# EAGLE design eLite Clock - Main (EAGLE 9.6.0)
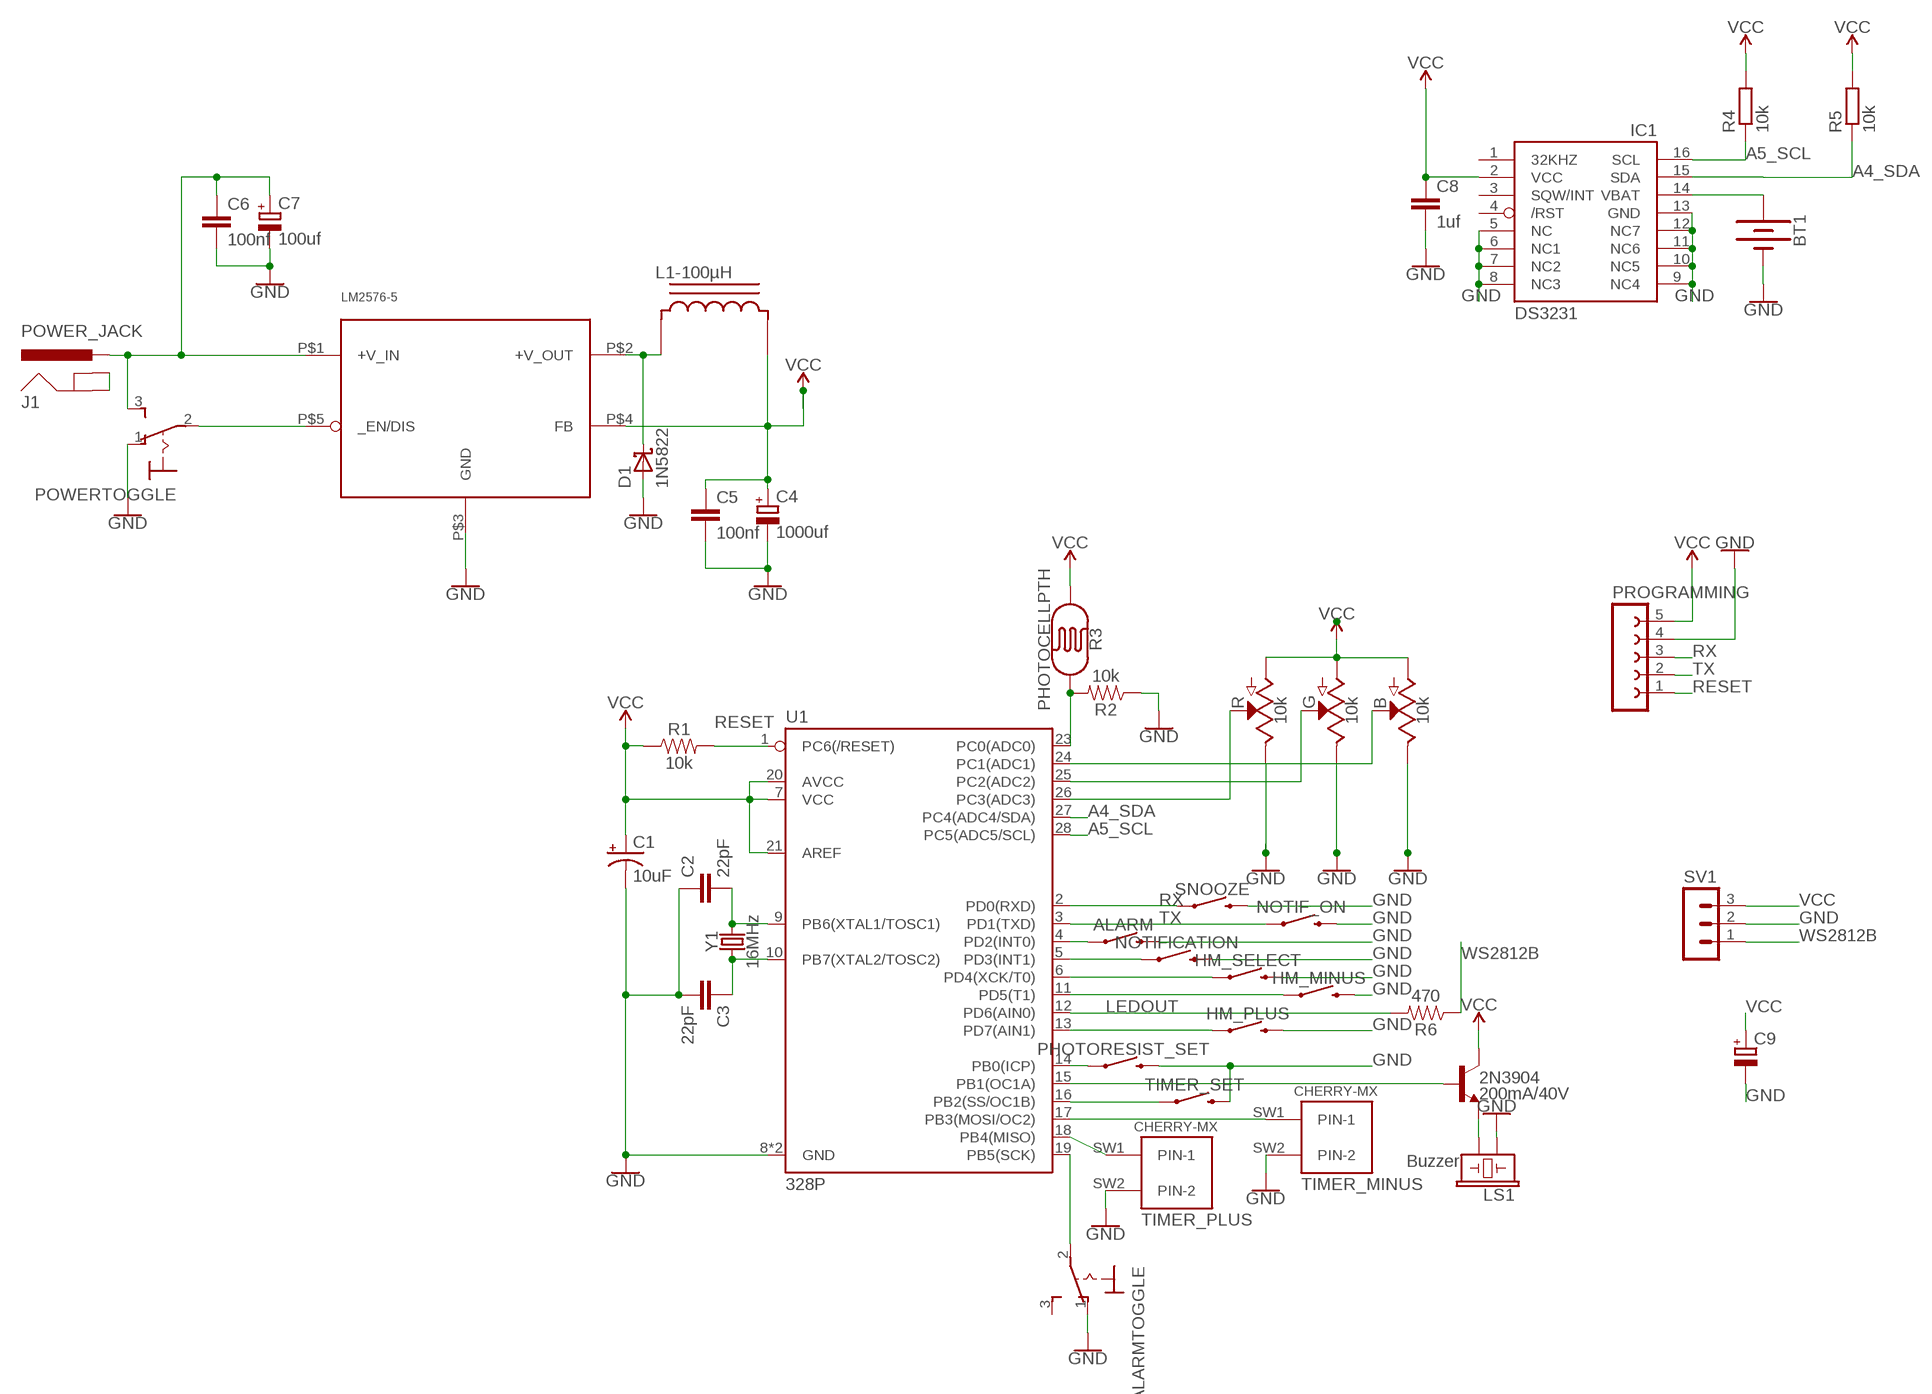
[diagram p0: schematic, sheet 1]

## Parts
2N3904  200mA/40V  TRANS_NPN-2N3904  [TO-92]
ALARM  MOMENTARY-SWITCH-SPST-PTH-6.0MM  [TACTILE_SWITCH_PTH_6.0MM]
ALARMTOGGLE  320-916  [320-916]
B  10k  POT  [SINGLE_GANK_POTENTIOMETER]
BT1  BATTERY-20MM_PTH  [BATTCOM_20MM_PTH]
C1  10uF  10UF-POLAR-RADIAL-2.5MM-25V-20%  [CPOL-RADIAL-2.5MM-5MM]
C2  22pF  22PF-PTH-2.54MM-200V-5%  [CAP-PTH-2.54]
C3  22pF  22PF-PTH-2.54MM-200V-5%  [CAP-PTH-2.54]
C4  1000uf  CPOL-EUE5-13  [E5-13]
C5  100nf  C-EU025-025X050  [C025-025X050]
C6  100nf  C-EU025-025X050  [C025-025X050]
C7  100uf  CPOL-EUE2.5-5  [E2,5-5]
C8  1uf  C-EU025-025X050  [C025-025X050]
C9  CPOL-EUE3.5-10  [E3,5-10]
D1  1N5822  [DIOAD2120W130L950D530P]
G  10k  POT  [SINGLE_GANK_POTENTIOMETER]
HM_MINUS  MOMENTARY-SWITCH-SPST-PTH-6.0MM  [TACTILE_SWITCH_PTH_6.0MM]
HM_PLUS  MOMENTARY-SWITCH-SPST-PTH-6.0MM  [TACTILE_SWITCH_PTH_6.0MM]
HM_SELECT  MOMENTARY-SWITCH-SPST-PTH-6.0MM  [TACTILE_SWITCH_PTH_6.0MM]
IC1  DS3231/SO  [SO16W]
J1  POWER_JACK  [POWER_JACK_PTH]
L1-100µH  T37_INDUCTOR  [T37_INDUCTOR]
LM2576-5  LM2576-T05A  [TO-220-5_IN-LINE]
LS1  Buzzer  BUZZER-PTH  [BUZZER-12MM]
NOTIF_ON  MOMENTARY-SWITCH-SPST-PTH-6.0MM  [TACTILE_SWITCH_PTH_6.0MM]
NOTIFICATION  MOMENTARY-SWITCH-SPST-PTH-6.0MM  [TACTILE_SWITCH_PTH_6.0MM]
PHOTORESIST_SET  MOMENTARY-SWITCH-SPST-PTH-6.0MM  [TACTILE_SWITCH_PTH_6.0MM]
POWERTOGGLE  320-916  [320-916]
PROGRAMMING  FE05-1  [FE05-1]
R  10k  POT  [SINGLE_GANK_POTENTIOMETER]
R1  10k  10KOHM-HORIZ-1/4W-1%  [AXIAL-0.3]
R2  10k  10KOHM-HORIZ-1/4W-1%  [AXIAL-0.3]
R3  PHOTOCELLPTH  [PHOTOCELL]
R4  10k  R-EU_0207/7  [0207/7]
R5  10k  R-EU_0207/7  [0207/7]
R6  470  10KOHM-HORIZ-1/4W-1%  [AXIAL-0.3]
SNOOZE  MOMENTARY-SWITCH-SPST-PTH-6.0MM  [TACTILE_SWITCH_PTH_6.0MM]
SV1  MA03-1  [MA03-1]
TIMER_MINUS  TIMER_PLUS  CHERRY-MX  [CHERRY-MX]
TIMER_PLUS  TIMER_MINUS  CHERRY-MX  [CHERRY-MX]
TIMER_SET  MOMENTARY-SWITCH-SPST-PTH-6.0MM  [TACTILE_SWITCH_PTH_6.0MM]
U1  328P  ATMEGA328P_PDIP  [DIP28]
Y1  16MHz  CRYSTAL-16MHZPTH-HC49US  [HC49US]

## Nets
A4_SDA: IC1.15(SDA) R5.1 U1.27(PC4(ADC4/SDA))
A5_SCL: IC1.16(SCL) R4.1 U1.28(PC5(ADC5/SCL))
GND: ALARM.3 ALARMTOGGLE.1(O) B.P$1 BT1.2(-) C1.2(-) C2.1 C3.2 C4.- C5.2 C6.2 C7.- C8.2 C9.- D1.A G.P$1 HM_MINUS.3 HM_PLUS.3 HM_SELECT.3 IC1.5(NC) IC1.6(NC1) IC1.7(NC2) IC1.8(NC3) IC1.9(NC4) IC1.10(NC5) IC1.11(NC6) IC1.12(NC7) IC1.13(GND) LM2576-5.P$3(GND) LS1.+ NOTIF_ON.3 NOTIFICATION.3 PHOTORESIST_SET.3 POWERTOGGLE.1(O) PROGRAMMING.4 R2.P$1 R.P$1 SNOOZE.3 SV1.2 TIMER_MINUS.SW2(PIN-2) TIMER_PLUS.SW2(PIN-2) TIMER_SET.3 U1.8(GND) U1.22(GND)
LEDOUT: R6.P$2 U1.12(PD6(AIN0))
N$1: J1.GND J1.GNDBREAK
N$2: C2.2 U1.9(PB6(XTAL1/TOSC1)) Y1.2
N$3: C3.1 U1.10(PB7(XTAL2/TOSC2)) Y1.1
N$4: ALARM.1 U1.4(PD2(INT0))
N$5: NOTIFICATION.1 U1.5(PD3(INT1))
N$6: HM_SELECT.1 U1.6(PD4(XCK/T0))
N$7: HM_MINUS.1 U1.11(PD5(T1))
N$8: PHOTORESIST_SET.1 U1.14(PB0(ICP))
N$9: HM_PLUS.1 U1.13(PD7(AIN1))
N$10: TIMER_MINUS.SW1(PIN-1) U1.17(PB3(MOSI/OC2))
N$11: TIMER_SET.1 U1.16(PB2(SS/OC1B))
N$12: TIMER_PLUS.SW1(PIN-1) U1.18(PB4(MISO))
N$13: 2N3904.2(B) U1.15(PB1(OC1A))
N$14: 2N3904.1(E) LS1.-
N$15: ALARMTOGGLE.2(P) U1.19(PB5(SCK))
N$16: R2.P$2 R3.2 U1.23(PC0(ADC0))
N$17: R.P$2 U1.26(PC3(ADC3))
N$18: D1.C L1-100µH.CB LM2576-5.P$2(+V_OUT)
N$19: LM2576-5.P$5(_EN/DIS) POWERTOGGLE.2(P)
N$21: G.P$2 U1.25(PC2(ADC2))
N$22: B.P$2 U1.24(PC1(ADC1))
N$24: C6.1 C7.+ J1.PWR LM2576-5.P$1(+V_IN) POWERTOGGLE.3(S)
N$26: BT1.1(+) IC1.14(VBAT)
RESET: PROGRAMMING.1 R1.P$2 U1.1(PC6(/RESET))
RX: PROGRAMMING.3 SNOOZE.1 U1.2(PD0(RXD))
TX: NOTIF_ON.1 PROGRAMMING.2 U1.3(PD1(TXD))
VCC: 2N3904.3(C) B.P$3 C1.1(+) C4.+ C5.1 C8.1 C9.+ G.P$3 IC1.2(VCC) L1-100µH.CA LM2576-5.P$4(FB) PROGRAMMING.5 R1.P$1 R3.1 R4.2 R5.2 R.P$3 SV1.3 U1.7(VCC) U1.20(AVCC) U1.21(AREF)
WS2812B: R6.P$1 SV1.1
Unconnected: ALARMTOGGLE.3(S) IC1.1(32KHZ) IC1.3(SQW/INT) IC1.4(/RST)

## Library data of the parts
2N3904 = SparkFun-DiscreteSemi:TRANS_NPN: NPN transistor Current controlled devices typically used to amplify current or used as a switch. BC547 - COM-08928 <http://www.sparkfun.com/products/8928> (TO-92 45V 100mA) (1.Collector 2.Base 3.Emitter) 2N3904 - COM-00521 <http://www.sparkfun.com/products/521> (TO-92 40V 200mA) (1.Emitter 2.Base 3.Collector) P2N2222A - COM-12852 <http://www.sparkfun.com/products/12852> (TO-92 40V 600mA) (1.Collector 2.Base 3.Emitter); PROD_ID: TRANS-08447
ALARM HM_MINUS HM_PLUS HM_SELECT NOTIF_ON NOTIFICATION PHOTORESIST_SET SNOOZE TIMER_SET = SparkFun-Switches:MOMENTARY-SWITCH-SPST: Momentary Switch (Pushbutton) - SPST Normally-open (NO) SPST momentary switches (buttons, pushbuttons). Variants PTH-12MM - 12mm square, through-hole Momentary Pushbutton Switch - 12mm Square <https://www.sparkfun.com/products/9190> (COM-09190) PTH-6.0MM, PTH-6.0MM-KIT - 6.0mm square, through-hole Mini Pushbutton Switch <https://www.sparkfun.com/products/97> (COM-00097) KIT package intended for soldering kit's - only one side of pads' copper is exposed. PTH-RIGHT-ANGLE-KIT - Right-angle, through-hole Right Angle Tactile Button <https://www.sparkfun.com/products/10791> - Used on SparkFun BigTime Watch Kit <https://www.sparkfun.com/products/11734> SMD-12MM - 12mm square, surface-mount Tactile Button - SMD (12mm) <https://www.sparkfun.com/products/12993> (COM-12993) Used on SparkFun PicoBoard <https://www.sparkfun.com/products/11888> SMD-4.5MM - 4.5mm Square Trackball Switch Used on SparkFun Blackberry Trackballer Breakout <https://www.sparkfun.com/products/13169> SMD-4.6MMX2.8MM - 4.60mm x 2.80mm, surface mount Used on SparkFun SAMD21 Mini Breakout <https://www.sparkfun.com/products/13664> SMD-5.2MM, SMD-5.2-REDUNDANT - 5.2mm square, surface-mount Mini Pushbutton Switch - SMD <https://www.sparkfun.com/products/8720> (COM-08720) Used on Arduino Pro Mini <https://www.sparkfun.com/products/11114> REDUNDANT package connects both switch circuits together SMD-6.0X3.5MM - 6.0 x 3.5mm, surface mount Momentary Reset Switch SMD <https://www.sparkfun.com/products/8229> (COM-08229) SMD-6.2MM-TALL - 6.2mm square, surface mount Tactile Button - SMD (6mm) <https://www.sparkfun.com/products/12992> Used on SparkFun Digital Sandbox <https://www.sparkfun.com/products/12651> SMD-RIGHT-ANGLE - Right-angle, surface mount Used on SparkFun Block for Intel® Edison - Arduino <https://www.sparkfun.com/products/13036>; PROD_ID: SWCH-08441; SF_SKU: COM-00097
ALARMTOGGLE POWERTOGGLE = switch:320-916: TOGGLE SWITCH distributor RS Components
B G R = SingleGankPotentiometer:POT
BT1 = SparkFun-Batteries:BATTERY: Battery - Single Cell A variety of battery chemistries, sizes, and footprints. Device List: 20MM_PTH - Coin Cell Battery Holder - 20mm (PTH) <https://www.sparkfun.com/products/783> 20MM_PTH_KIT- Coin Cell battery Holder - 20 mm (PTH) <http://www.sparkfun.com/products/783>kit version with special mask 6.8MM_PTH - Coin Cell Battery Holder - 6.8MM(SMD) <https://www.digikey.com/product-detail/en/seiko-instruments/MS621FE-FL11E/728-1057-ND/1889208?WT.srch=1&gclid=CNOQ5a6LzdQCFZS2wAodXCkE0g> 12MM_SMD - Coin Cell Battery Holder - 12mm (SMD) <https://www.sparkfun.com/products/10592> 12MM_PTH - Coin Cell Battery Holder - 12mm (PTH) <https://www.sparkfun.com/products/7948> 20MM_SMD - 20mm Coin Cell Battery Holder (SMD) (2 legs) Used on the Big Time Watch Kit <https://www.sparkfun.com/products/11734> 20MM_SMD_4LEGS - Coin Cell Battery Holder - 20mm (SMD) <https://www.sparkfun.com/products/11892> 20MM_SMD_4LEGS_OVERPASTE - Coin Cell Battery Holder - 20mm (SMD) <https://www.sparkfun.com/products/11892> (Over-paste on the legs) 24.5MM_PTH - Coin Cell Battery Holder - 24.5mm (PTH) <https://www.sparkfun.com/products/8863> 9V - 9V Battery Holder - PC Mount Used on the SparkFun SparkPunk Sound Kit <https://www.sparkfun.com/products/11177> and SparkFun SparkPunk Sequencer Kit <https://www.sparkfun.com/products/12707> 18650 - Battery Holder - 18650 (PTH) <https://www.sparkfun.com/products/13113> AA - Battery Holder - 1xAA (PTH) <https://www.sparkfun.com/products/7949> AAA - Battery Holder - 1xAAA (PTH) <https://www.sparkfun.com/products/12718> AA_KIT - Battery Holder - 1xAA (PTH) <https://www.sparkfun.com/products/7949> Special kit package - pads only have exposed copper on one side of the board. AAA_KIT - Battery Holder - 1xAAA (PTH) <https://www.sparkfun.com/products/12718> Special kit package - pads only have exposed copper on one side of the board.; PROD_ID: BATT-09031; SF_SKU: PRT-00783
C1 = SparkFun-Capacitors:10UF-POLAR: 10.0µF polarized capacitors A capacitor is a passive two-terminal electrical component used to store electrical energy temporarily in an electric field.; PROD_ID: CAP-08440
C2 C3 = SparkFun-Capacitors:22PF: 22pF ceramic capacitors A capacitor is a passive two-terminal electrical component used to store electrical energy temporarily in an electric field.; PROD_ID: CAP-09128
C4 C7 C9 = rcl:CPOL-EU: POLARIZED CAPACITOR, European symbol; SPICEPREFIX: C
C5 C6 C8 = rcl:C-EU: CAPACITOR, European symbol; SPICEPREFIX: C
D1 = 1N5822:1N5822: 1N5822 Series 40 V 3 A Through Hole Schottky Rectifier - DO-201AD; AVAILABILITY: Unavailable; DESCRIPTION: Schottky Barrier Rectifier, 3.0 A, 40 V; MF: STMicroelectronics; MP: 1N5822; PACKAGE: SQ-MELF B ON Semiconductor; PRICE: None
IC1 = adafruit:DS3231
J1 = SparkFun-Connectors:POWER_JACK: Power Jack Connector This is the standard 5.5mm barrel jack for power. The PTH is the most common, proven, reliable, footprint. The Slot footprint only works if the mill layer is transmitted to the PCB fab house so be warned. Here are the connectors we sell at SparkFun: DC Barrel Power Jack/Connector <https://www.sparkfun.com/products/119> (PRT-00119) DC Barrel Power Jack/Connector (SMD) <https://www.sparkfun.com/products/12748> (PRT-12748) DC Barrel Jack Adapter - Breadboard Compatible <https://www.sparkfun.com/products/10811> (PRT-10811) It is used on this SparkFun product (and many, many others): SparkFun RedBoard - Programmed with Arduino <https://www.sparkfun.com/products/12757> (DEV-12757) Also, if you need a mating power supply or connector, please check these out: Wall Adapter Power Supply - 9VDC 650mA <https://www.sparkfun.com/products/298> (TOL-00298) DC Barrel Jack Adapter - Male <https://www.sparkfun.com/products/10287> (PRT-10287); PROD_ID: CONN-08197
L1-100µH = toroid:T37_INDUCTOR: Inductor wound on a T37 Toroid
LM2576-5 = LM2576:LM2576-T05A: LM2576/LM2576HV Series SIMPLE SWITCHER® 3A Step-Down Voltage Regulator IN-LINE PACKAGE; SPICEPREFIX: X
LS1 = SparkFun-Electromechanical:BUZZER: Buzzer Small round buzzers that operate around the audible 2kHz range. You can use these as speakers to create simple music or user interfaces. Variant Overview: PTH - Mini Speaker - PC Mount 12mm 2.048kHz <https://www.sparkfun.com/products/7950> PTH_KIT - Mini Speaker - PC Mount 12mm 2.048kHz <https://www.sparkfun.com/products/7950> KIT simplifies soldering by adding stop mask to one side of the pads. PTH_NO_SILK - Mini Speaker - PC Mount 12mm 2.048kHz <https://www.sparkfun.com/products/7950> No silkscreen indicator of buzzer outline. PTH_KIT_NO_SILK - Mini Speaker - PC Mount 12mm 2.048kHz <https://www.sparkfun.com/products/7950> KIT package w/o silkscreen SMD - Buzzer Audio Magnetic (CCV-084B16) SMD buzzer used on, e.g. the LilyPad Buzzer <https://www.sparkfun.com/products/8463> and RFID USB Reader <https://www.sparkfun.com/products/9963>. SMD_KIT - Buzzer Audio Magnetic (CCV-084B16) SMD Buzzer with elongated pins to make soldering easier. Used on the SparkFun Simon Says - Surface Mount Soldering Kit <https://www.sparkfun.com/products/10935>.; PROD_ID: COMP-08253; SF_SKU: COM-07950
PROGRAMMING = con-lsta:FE05-1: FEMALE HEADER; OC_FARNELL: unknown; OC_NEWARK: unknown
R1 R2 = SparkFun-Resistors:10KOHM: 10kΩ resistor A resistor is a passive two-terminal electrical component that implements electrical resistance as a circuit element. Resistors act to reduce current flow, and, at the same time, act to lower voltage levels within circuits. - Wikipedia; PROD_ID: RES-12183
R3 = SparkFun-Sensors:PHOTOCELL: Photocell (Photodetector, Photo Resistor, CdS) This is a very small light sensor. A photocell changes (also called a photodetector, photo resistor, CdS or photoconductive cell) resistance depending on the amount of light it is exposed to. These little sensors make great ambient light triggers (when light in the room turns on, do something). Datasheet <http://cdn.sparkfun.com/datasheets/Sensors/LightImaging/SEN-09088.pdf> SparkFun Products Mini Photocell <https://www.sparkfun.com/products/9088> (SEN-09088); PROD_ID: COMP-09129; SF_ID: SEN-09088
R4 R5 = rcl:R-EU_: RESISTOR, European symbol; SPICEPREFIX: R
R6 = SparkFun-Resistors:10KOHM: 10kΩ resistor A resistor is a passive two-terminal electrical component that implements electrical resistance as a circuit element. Resistors act to reduce current flow, and, at the same time, act to lower voltage levels within circuits. - Wikipedia; PROD_ID: RES-12183; VALUE: 10k
SV1 = con-lstb:MA03-1: PIN HEADER; OC_FARNELL: unknown; OC_NEWARK: unknown
TIMER_MINUS TIMER_PLUS = cherrymx:CHERRY-MX: Cherry MX series keyswitch
U1 = SparkFun-IC-Microcontroller:ATMEGA328P_PDIP: Atmel 328P Through hole ATMEGA328P uC used in the Arduino 32kb flash, 1k EEPROM, 2k SRAM Datasheet <http://www.sparkfun.com/datasheets/Components/SMD/ATMega328.pdf> SparkFun Products Storefront component: AVR 28 Pin 20MHz 32K 6A/D - ATMega328P <https://www.sparkfun.com/products/9061> (COM-09061) SparkFun Simon Says - Through-Hole Soldering Kit <https://www.sparkfun.com/products/10547> (KIT-10547) SparkFun Learn to Solder - Simon Says <https://www.sparkfun.com/products/13708> (KIT-13708) SparkFun BigTime Watch Kit <https://www.sparkfun.com/products/11734> (KIT-11734) SparkFun ClockIt <https://www.sparkfun.com/products/10930> (KIT-10930) SparkFun Serial Enabled LCD Kit <https://www.sparkfun.com/products/10097> (LCD-10097) SparkFun Simon Tilts - Through Hole Soldering Kit <https://www.sparkfun.com/products/12634> (KIT-12634) SparkFun Frequency Counter Kit <https://www.sparkfun.com/products/10140> (KIT-10140) FabFM Radio Kit <https://www.sparkfun.com/products/11043> (KIT-11043) SparkFun Binary Blaster Kit <https://www.sparkfun.com/products/12037> (KIT-12037) SparkFun Metro-Gnome <https://www.sparkfun.com/products/9236> (KIT-09236) ATmega328 with Arduino Optiboot (Uno) <https://www.sparkfun.com/products/10524> (DEV-10524); PROD_ID: IC-09136
Y1 = SparkFun-Clocks:CRYSTAL-16MHZ: 16MHz Crystal Digikey Example <http://www.digikey.com/product-search/en?keywords=535-9122-1-ND> Frequency: 16MHz Frequency Stability: ±50ppm Frequency Tolerance: ±20ppm Load Capacitance: 18pF SparkFun Products: Pro Micro -5V/16MHz <https://www.sparkfun.com/products/12640> SparkFun Serial Enabled LCD Kit <https://www.sparkfun.com/products/10097>; PROD_ID: XTAL-08181; SF_ID: COM-00536

## Board
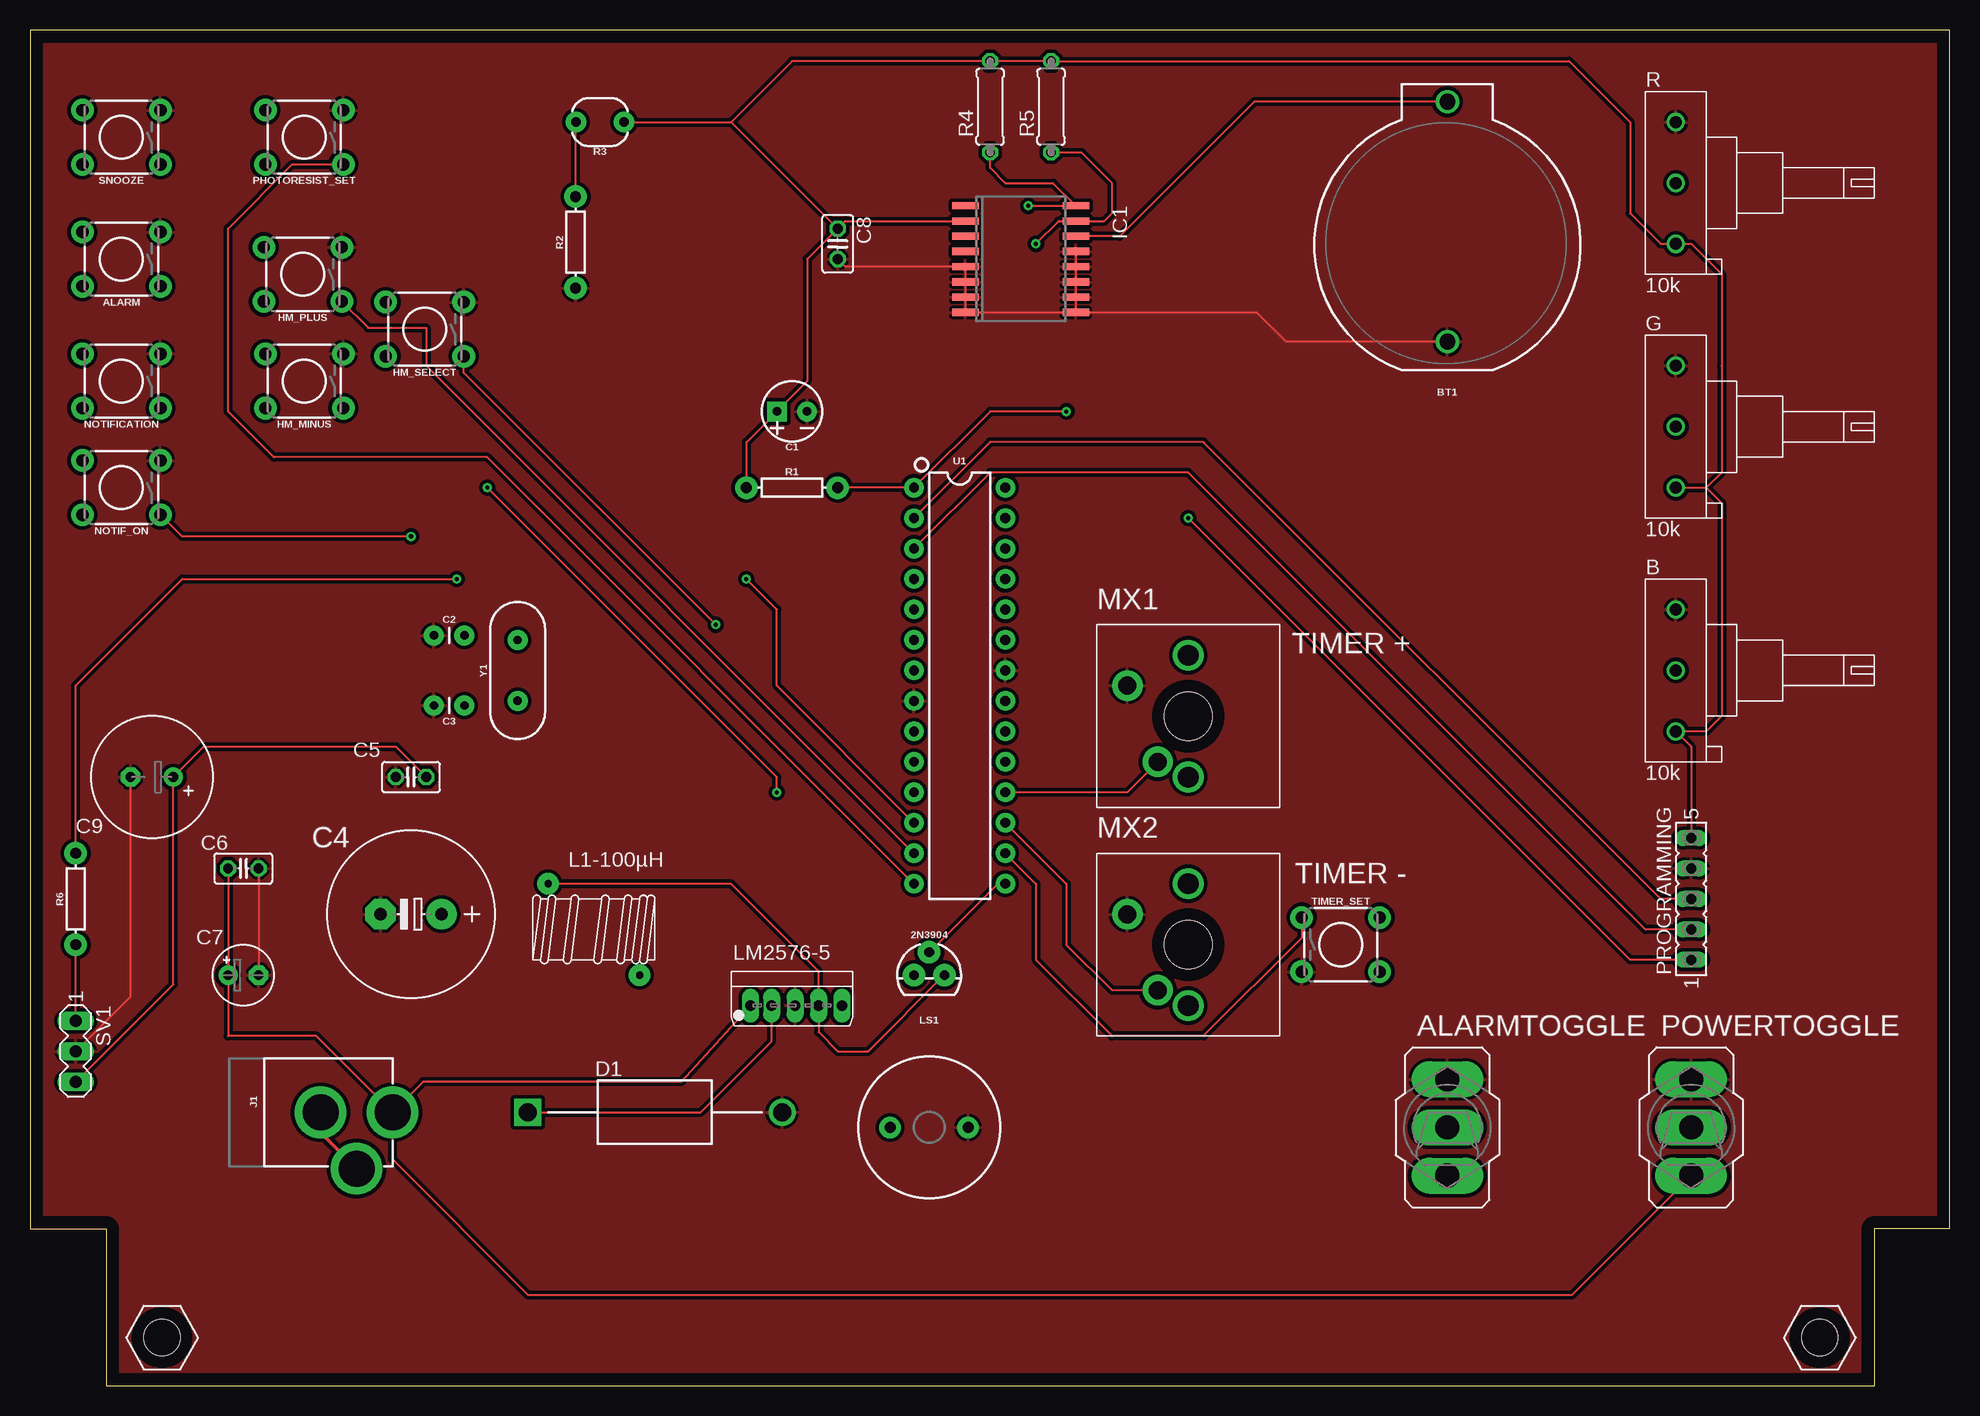
[diagram p1: board, top side]
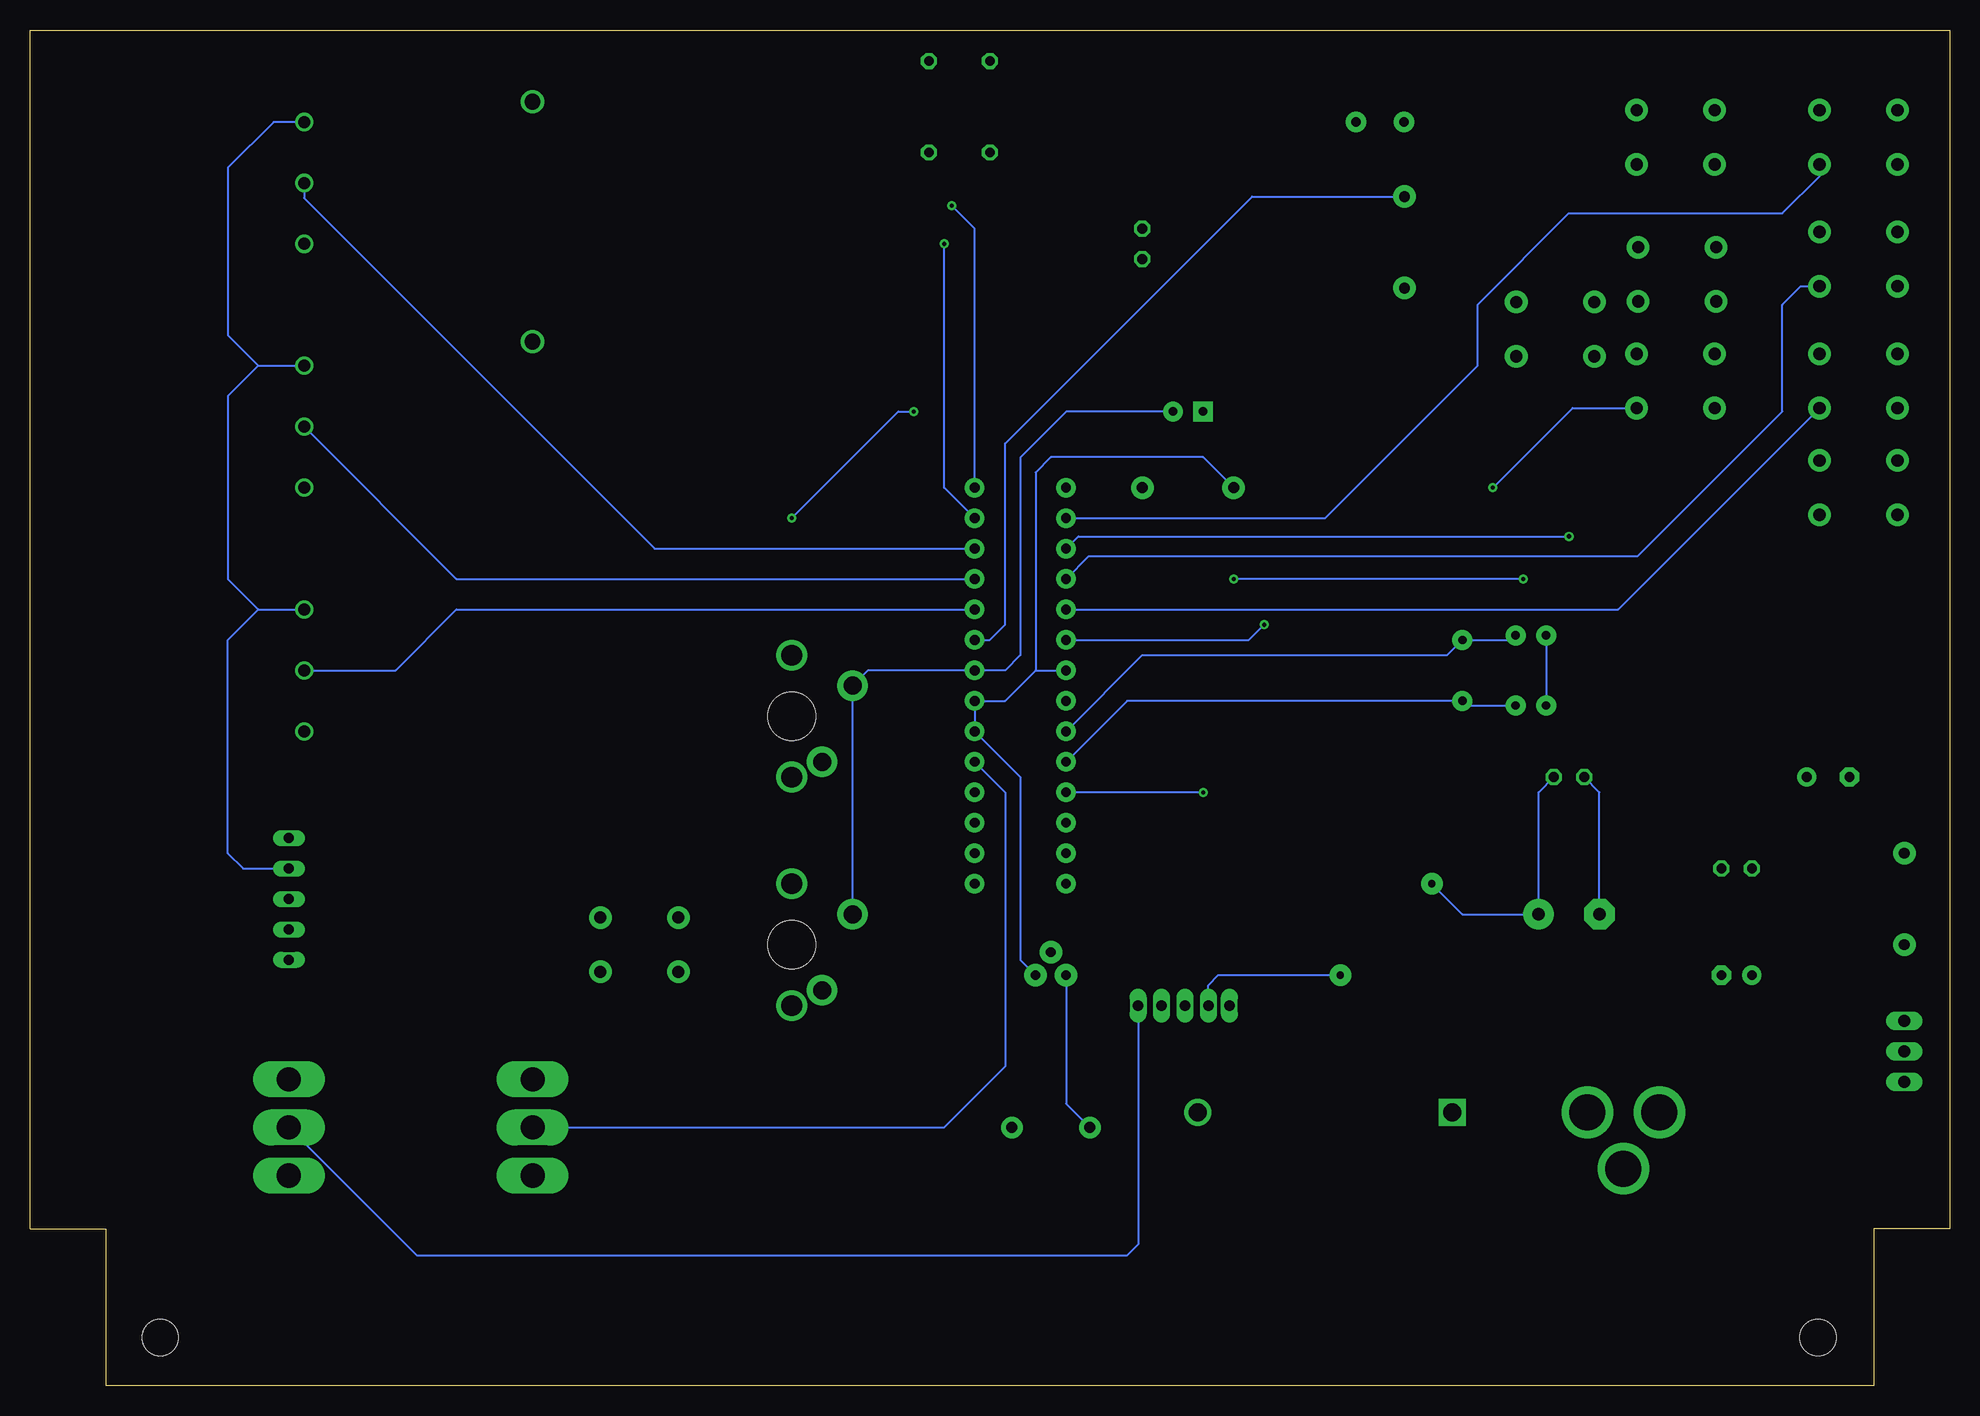
[diagram p2: board, bottom side, seen from below]

Size 160 x 113 mm. Coordinates in mm from the lower left corner, seen from the top.
Outline: 6.35,0 153.67,0 153.67,13.05 160,13.05 160,113 0,113 0,13.05 6.35,13.05 6.35,0
Copper layers (1*16): Top 0.035mm / dielectric 1.5mm / Bottom 0.035mm
Design rules "default": minimum track width 6mil, minimum drill 0.35mm, track to track 6mil, track to pad 6mil, pad to pad 6mil, via to via 6mil, smd to smd 6mil, copper to edge 40mil, drill to drill 6mil, minimum pad ring 10mil, minimum via ring 8mil, stop-mask expansion 4mil, vias tented up to drill 0mil, thermal gap 10mil
Holes 3 mm at 11,4 149.15,4

### Footprints (pad centres in the part's own frame; a part is rotated, then mirrored left to right if it is on the bottom)
TO-92 = drill 0.813 pad 1.88: 1 -1.27,0; 2 0,1.905; 3 1.27,0
TACTILE_SWITCH_PTH_6.0MM = drill 1.016 pad 1.88: 1 -3.251,2.261; 2 3.251,2.261; 3 -3.251,-2.261; 4 3.251,-2.261
320-916 = drill 2.007 long: 1 0,4.013; 2 0,0; 3 0,-4.013
SINGLE_GANK_POTENTIOMETER = drill 1: P$1 0,0; P$2 0,-5.08; P$3 0,-10.16
BATTCOM_20MM_PTH = drill 1.3: 1 11.85,0; 2 -8.15,0
CPOL-RADIAL-2.5MM-5MM = drill 0.7 pad 1.651 square: 1 1.25,0 | drill 0.7 pad 1.651: 2 -1.25,0
CAP-PTH-2.54 = drill 0.7 pad 1.651: 1 -1.27,0; 2 1.27,0
E5-13 = drill 1.016 pad 2.54: + -2.54,0 | drill 1.016 pad 2.54 octagon: - 2.54,0
C025-025X050 = drill 0.813 octagon: 1 -1.27,0; 2 1.27,0
E2,5-5 = drill 0.813 pad 1.6: + -1.27,0 | drill 0.813 pad 1.6 octagon: - 1.27,0
E3,5-10 = drill 0.813 pad 1.6: + -1.778,0 | drill 0.813 pad 1.6 octagon: - 1.778,0
DIOAD2120W130L950D530P = drill 1.5 pad 2.25: A 10.6,0 | drill 1.5 pad 2.25 square: C -10.6,0
SO16W = smd 0.6 x 2.2: 1 -4.445,-4.6; 2 -3.175,-4.6; 3 -1.905,-4.6; 4 -0.635,-4.6; 5 0.635,-4.6; 6 1.905,-4.6; 7 3.175,-4.6; 8 4.445,-4.6; 9 4.445,4.6; 10 3.175,4.6; 11 1.905,4.6; 12 0.635,4.6; 13 -0.635,4.6; 14 -1.905,4.6; 15 -3.175,4.6; 16 -4.445,4.6
POWER_JACK_PTH = drill 2.997 pad 4.318: GND 0,7.7; GNDBREAK 4.7,10.7; PWR 0,13.7
T37_INDUCTOR = drill 0.6 pad 1.778: CA -3.81,-3.81; CB 3.81,3.81
TO-220-5_IN-LINE = drill 0.889 pad 1.016 long: P$1 -3.454,0; P$2 -1.702,0; P$3 0.254,0; P$4 2.21,0; P$5 4.166,0
BUZZER-12MM = drill 0.9 pad 1.778: + 3.25,0; - -3.25,0
FE05-1 = drill 0.813 long: 1 -5.08,0; 2 -2.54,0; 3 0,0; 4 2.54,0; 5 5.08,0
AXIAL-0.3 = drill 0.9 pad 1.88: P$1 -3.81,0; P$2 3.81,0
PHOTOCELL = drill 0.8 pad 1.676: 1 -2,0; 2 2,0
0207/7 = drill 0.813 octagon: 1 -3.81,0; 2 3.81,0
MA03-1 = drill 1.016 long: 1 -2.54,0; 2 0,0; 3 2.54,0
CHERRY-MX = drill 1.714 pad 1.93: P$3 -5.08,0; P$4 5.08,0 | drill 1.5 pad 2.54: SW1 -3.81,2.54; SW2 2.54,5.08 | hole 4: 0,0
DIP28 = drill 0.813 pad 1.626: 1 -16.51,-3.81; 2 -13.97,-3.81; 3 -11.43,-3.81; 4 -8.89,-3.81; 5 -6.35,-3.81; 6 -3.81,-3.81; 7 -1.27,-3.81; 8 1.27,-3.81; 9 3.81,-3.81; 10 6.35,-3.81; 11 8.89,-3.81; 12 11.43,-3.81; 13 13.97,-3.81; 14 16.51,-3.81; 15 16.51,3.81; 16 13.97,3.81; 17 11.43,3.81; 18 8.89,3.81; 19 6.35,3.81; 20 3.81,3.81; 21 1.27,3.81; 22 -1.27,3.81; 23 -3.81,3.81; 24 -6.35,3.81; 25 -8.89,3.81; 26 -11.43,3.81; 27 -13.97,3.81; 28 -16.51,3.81
HC49US = drill 0.7 pad 1.651: 1 -2.54,0; 2 2.54,0

### Placement (x,y rotation side)
2N3904  74.93,34.21 0 top
ALARM  7.62,93.9 180 top
ALARMTOGGLE  118.11,21.51 0 top
B  137.16,64.69 0 top
BT1  118.11,95.17 90 top
C1  63.5,81.2 180 top
C2  34.92,62.53 0 top
C3  34.92,56.69 180 top
C4  31.75,39.29 180 top
C5  31.75,50.72 180 top
C6  17.78,43.1 0 top
C7  17.78,34.21 0 top
C8  67.31,95.17 270 top
C9  10.16,50.72 180 top
D1  52.07,22.78 0 top
G  137.16,85.01 0 top
HM_MINUS  22.86,83.74 180 top
HM_PLUS  22.73,92.63 180 top
HM_SELECT  32.89,88.06 180 top
IC1  82.55,93.9 270 top
J1  16.51,22.78 270 top
L1-100µH  46.99,38.02 270 top
LM2576-5  63.5,31.67 0 top
LS1  74.93,21.51 0 top
NOTIF_ON  7.62,74.85 180 top
NOTIFICATION  7.62,83.74 180 top
PHOTORESIST_SET  22.86,104.06 180 top
POWERTOGGLE  138.43,21.51 0 top
PROGRAMMING  138.43,40.56 90 top
R  137.16,105.33 0 top
R1  63.5,74.85 0 top
R2  45.47,95.3 90 top
R3  47.5,105.33 180 top
R4  80.01,106.6 90 top
R5  85.09,106.6 90 top
R6  3.81,40.56 90 top
SNOOZE  7.62,104.06 180 top
SV1  3.81,27.86 270 top
TIMER_MINUS  96.52,36.75 90 top
TIMER_PLUS  96.52,55.8 90 top
TIMER_SET  109.22,36.75 0 top
U1  77.47,58.34 270 top
Y1  40.64,59.61 90 top

### Tracks (layer width: path | path; a pad name or v marks a point on that pad's centre or on a via)
A4_SDA  (via drill 0.35)
  Top 0.152: R5.1 87.63,102.79 90.17,100.25 90.17,97.71 89.53,97.07 IC1.15 85.72,97.07 v83.82,95.17
  Bottom 0.152: U1.27 83.82,74.85 v83.82,95.17
A5_SCL  (via drill 0.35)
  Top 0.152: R4.1 80.01,101.52 81.28,100.25 85.25,100.25 IC1.16 v83.19,98.34
  Bottom 0.152: U1.28 81.28,96.44 v83.19,98.34
GND
  Top 0.152: C8.2 67.94,93.26 IC1.5 IC1.8 IC1.9 | BT1.2 104.67,87.02 102.23,89.45 IC1.9 | IC1.13 IC1.9 | C6.2 C7.- | C9.- 8.38,32.43 SV1.2
  Bottom 0.152: PROGRAMMING.4 142.24,43.1 143.51,44.37 143.51,62.15 140.97,64.69 | 140.97,85.01 143.51,82.47 143.51,67.23 140.97,64.69 | 140.97,64.69 B.P$1 | R.P$1 139.7,105.33 143.51,101.52 143.51,87.55 140.97,85.01 | TIMER_MINUS.SW2 TIMER_PLUS.SW2 90.17,59.61 U1.22 78.74,59.61 77.47,60.88 77.47,77.37 73.64,81.2 C1.2 | C4.- 29.21,49.45 C5.2 | C2.1 C3.2 | 140.97,85.01 G.P$1
  pour Top (isolate 0.305): 0,0 0,112.95 160.02,112.95 160.02,0
LEDOUT  (via drill 0.35)
  Top 0.152: U1.12 62.23,58.34 62.23,64.69 v59.69,67.23 | R6.P$2 3.81,58.34 12.7,67.23 v35.56,67.23
  Bottom 0.152: v35.56,67.23 v59.69,67.23
N$1
  Top 0.305: J1.GND 24.21,21.08 J1.GNDBREAK
N$2
  Bottom 0.152: U1.9 67.31,60.88 41.91,60.88 Y1.2 36.58,62.15 C2.2
N$3
  Bottom 0.152: U1.10 68.58,57.07 Y1.1 40.26,56.69 C3.1
N$4
  Bottom 0.152: U1.4 71.75,69.13 26.04,69.13 13.97,81.2 13.97,90.09 12.42,91.64 ALARM.1
N$5
  Bottom 0.152: U1.5 27.66,64.69 NOTIFICATION.1
N$6  (via drill 0.35)
  Top 0.152: HM_SELECT.1 36.14,84.43 v57.15,63.42
  Bottom 0.152: U1.6 58.42,62.15 v57.15,63.42
N$7  (via drill 0.35)
  Top 0.152: v62.23,49.45 62.23,50.72 v38.1,74.85
  Bottom 0.152: v38.1,74.85 38.08,74.85 31.45,81.48 HM_MINUS.1 | v62.23,49.45 U1.11
N$8
  Top 0.152: U1.14 38.1,77.39 20.32,77.39 16.51,81.2 16.51,96.44 21.87,101.8 PHOTORESIST_SET.1
N$9
  Top 0.152: U1.13 33.02,85.01 33.02,88.18 28.17,88.18 HM_PLUS.1
N$10
  Top 0.152: TIMER_MINUS.SW1 90.17,32.94 86.36,36.75 86.36,41.83 U1.17
N$11
  Top 0.152: TIMER_SET.1 105.97,37.31 97.79,29.13 90.17,29.13 83.82,35.48 83.82,41.83 U1.16
N$12
  Top 0.152: TIMER_PLUS.SW1 91.44,49.45 U1.18
N$13
  Top 0.152: U1.15 80.64,41.83 2N3904.2
N$14
  Bottom 0.152: LS1.- 73.66,23.49 2N3904.1
N$15
  Bottom 0.152: ALARMTOGGLE.2 83.82,21.51 78.74,26.59 78.74,49.45 U1.19
N$16
  Top 0.152: R2.P$2 45.47,105.3 R3.2
  Bottom 0.152: U1.23 80.01,62.15 78.74,63.42 78.74,78.53 58.17,99.11 R2.P$2
N$17
  Bottom 0.152: R.P$2 137.16,98.98 107.95,69.77 U1.26
N$18
  Top 0.152: D1.C 55.88,22.78 61.8,28.7 LM2576-5.P$2
  Bottom 0.152: LM2576-5.P$2 61.8,33.37 60.96,34.21 L1-100µH.CB
N$19
  Bottom 0.152: POWERTOGGLE.2 127.76,10.84 68.58,10.84 67.67,11.76 LM2576-5.P$5
N$21
  Bottom 0.152: G.P$2 124.46,67.23 U1.25
N$22
  Bottom 0.152: B.P$2 129.54,59.61 124.46,64.69 U1.24
N$24
  Top 0.152: POWERTOGGLE.3 128.47,7.54 41.53,7.54 30.21,18.86 J1.PWR | C6.1 C7.+ 16.51,29.13 23.86,29.13 J1.PWR | LM2576-5.P$1 54.25,25.32 32.75,25.32 J1.PWR
N$26
  Top 0.152: BT1.1 102.02,107.02 90.81,95.8 IC1.14
RESET  (via drill 0.35)
  Top 0.152: PROGRAMMING.1 133.35,35.48 v96.52,72.31 | v86.36,81.2 80.01,81.2 U1.1 R1.P$2
  Bottom 0.152: v96.52,72.31 87.63,81.2 v86.36,81.2
RX
  Top 0.152: PROGRAMMING.3 135.89,40.56 97.79,78.66 80.01,78.66 U1.2
  Bottom 0.152: U1.2 52.07,72.31 39.37,85.01 39.37,90.09 31.75,97.71 13.97,97.71 10.87,100.81 SNOOZE.1
TX  (via drill 0.35)
  Top 0.152: PROGRAMMING.2 134.62,38.02 96.52,76.12 80.01,76.12 U1.3 | NOTIF_ON.1 12.68,70.79 v31.75,70.79
  Bottom 0.152: v31.75,70.79 72.64,70.79 U1.3
VCC
  Top 0.152: C8.1 67.94,97.07 IC1.2 | 139.7,74.85 140.97,76.12 140.97,85.01 140.97,92.63 138.43,95.17 R.P$3 135.89,95.17 133.35,97.71 133.35,105.33 128.27,110.41 R5.2 R4.2 63.5,110.41 58.42,105.33 | G.P$3 139.7,74.85 | 139.7,74.85 140.97,73.58 140.97,55.8 139.7,54.53 B.P$3 138.43,53.26 PROGRAMMING.5 | R1.P$1 59.69,78.66 59.71,78.66 C1.1 62.23,81.2 64.77,83.74 64.77,93.9 C8.1 | L1-100µH.CA 58.42,41.83 65.71,34.54 LM2576-5.P$4 65.71,29.46 67.31,27.86 69.85,27.86 2N3904.3 | R3.1 58.42,105.33 | 58.42,105.33 C8.1 | SV1.3 11.94,33.45 C9.+ 14.48,53.26 30.48,53.26 C5.1
  Bottom 0.152: L1-100µH.CA 40.64,39.29 C4.+ 34.29,49.45 C5.1 | R1.P$1 62.23,77.39 74.93,77.39 76.2,76.12 76.2,59.61 | 76.2,59.61 U1.7 | 76.2,59.61 78.74,57.07 U1.21 U1.20 77.47,50.72 77.47,35.48 2N3904.3
WS2812B
  Top 0.152: SV1.1 R6.P$1

### Text on the board
tNames: MX1 | TIMER + | MX2 | TIMER -